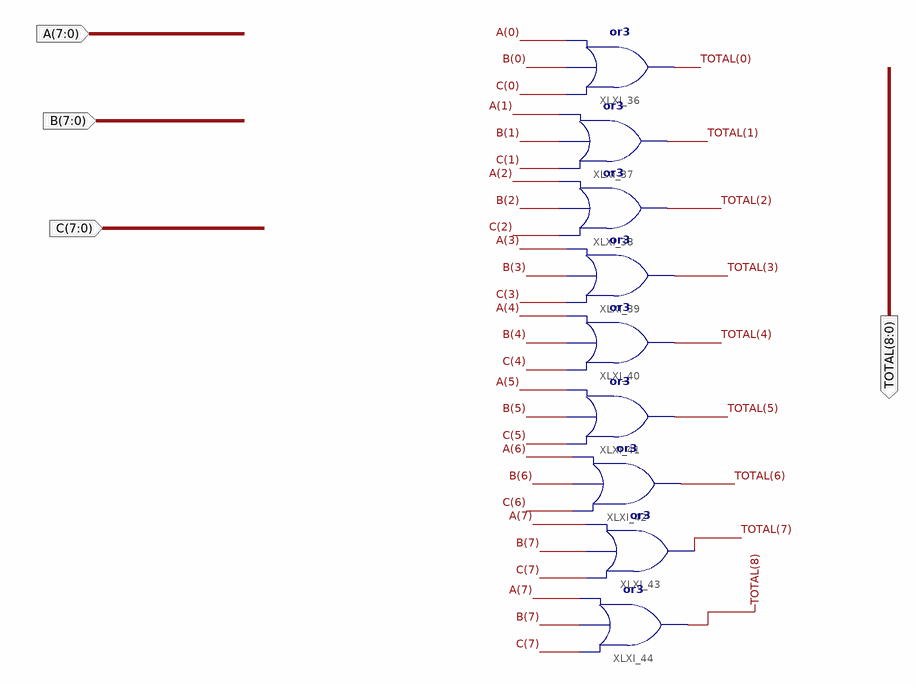
[diagram p0: schematic sheet 1]
// Xilinx ISE schematic Nine_Bit_OR.sch (spartan6) as structural Verilog: 9 symbols, 4 ports
module Nine_Bit_OR (
  input  [7:0] A,
  input  [7:0] B,
  input  [7:0] C,
  output [8:0] TOTAL
);

  or XLXI_36 (TOTAL[0], C[0], B[0], A[0]);
  or XLXI_37 (TOTAL[1], C[1], B[1], A[1]);
  or XLXI_38 (TOTAL[2], C[2], B[2], A[2]);
  or XLXI_39 (TOTAL[3], C[3], B[3], A[3]);
  or XLXI_40 (TOTAL[4], C[4], B[4], A[4]);
  or XLXI_41 (TOTAL[5], C[5], B[5], A[5]);
  or XLXI_42 (TOTAL[6], C[6], B[6], A[6]);
  or XLXI_43 (TOTAL[7], C[7], B[7], A[7]);
  or XLXI_44 (TOTAL[8], C[7], B[7], A[7]);
endmodule
